# EAGLE design trico_embed01_atmpt01 (EAGLE 9.1.0)
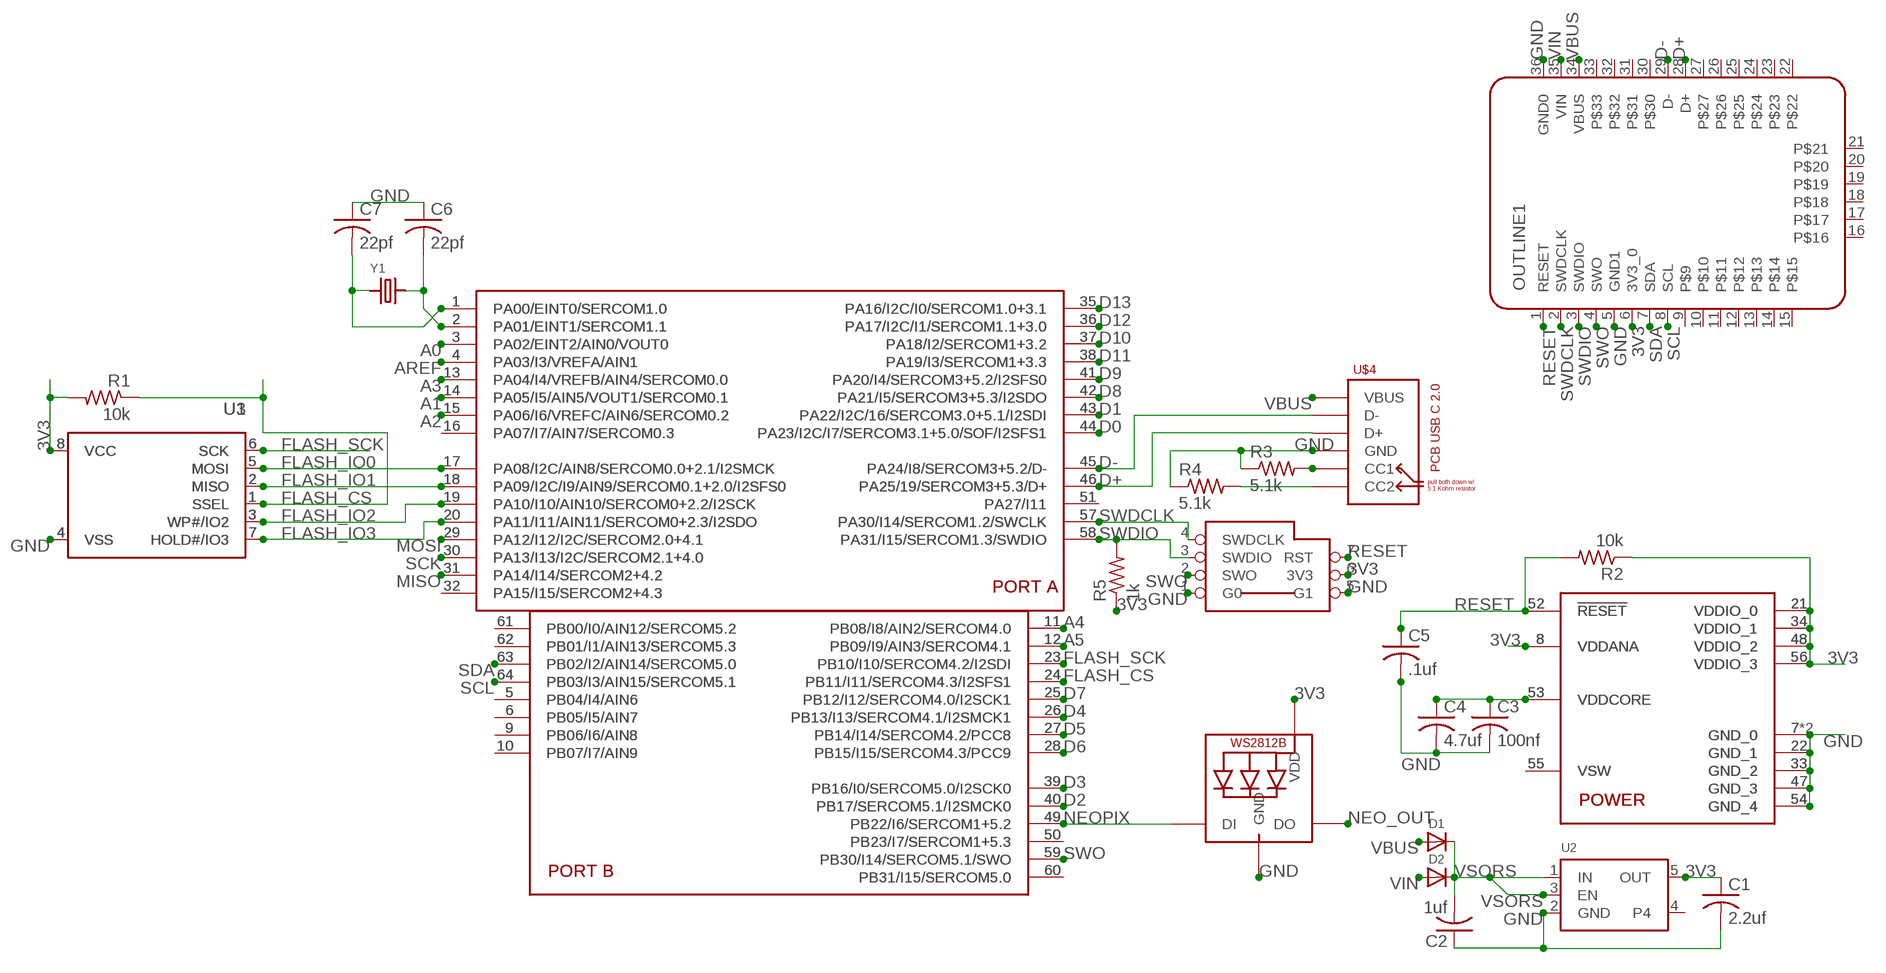
[diagram p0: schematic, sheet 1]

## Parts
C1  2.2uf  C-TG  [TG-C0805MP]
C2  1uf  C-TG  [TG-C0805MP]
C3  100nf  C-TG  [TG-C0805MP]
C4  4.7uf  C-TG  [TG-C0805MP]
C5  .1uf  C-TG  [TG-C0805MP]
C6  22pf  C-TG  [TG-C0805MP]
C7  22pf  C-TG  [TG-C0805MP]
D1  DIODESOD-123  [SOD-123]
D2  DIODESOD-123  [SOD-123]
LED1  LED-NEO-WS2812B3535  [LED3535]
OUTLINE1  TRIOC_DEV_36_EMBED_01BREAK  [TRICO_DEV_01_BRK_HYBRID]
R1  10k  R_TG  [TG-R0805]
R2  10k  R_TG  [TG-R0805]
R3  5.1k  R_TG  [TG-R0805]
R4  5.1k  R_TG  [TG-R0805]
R5  1k  R_TG  [TG-R0805]
U1  FLASH-SPI-SOIC8  [SOIC8_150MIL]
U2  VREG_STD_MIN_SOT23-5  [SOT23-5]
U3  FLASH-SPI-SOIC8208MIL  [SOIC8_208MIL]
U$1  MCU-ATSAMD51J-ADATQFP  [QFP50P1200X1200X120-64N]
U$2  MCU-ATSAMD51J-ADAADA  [MICROBUILDER_PQFN64-1]
U$3  SWD_POGO  [SWD_POGO]
U$4  USB-C-PCB-USB-2.0-TYPE-CDS_2  [USB_TYPE_C_DS_2]
Y1  XTAL_ADA4.9X1.8  [MICROBUILDER_CRYSTAL_4.9X1.8]

## Nets
3V3: C1.1 LED1.2(VDD) OUTLINE1.6(3V3_0) R1.2 R2.1 R5.1 U1.8(VCC) U2.5(OUT) U3.8(VCC) U$1.8(VDDANA) U$1.21(VDDIO_0) U$1.34(VDDIO_1) U$1.48(VDDIO_2) U$1.56(VDDIO_3) U$2.8(VDDANA) U$2.21(VDDIO_0) U$2.34(VDDIO_1) U$2.48(VDDIO_2) U$2.56(VDDIO_3) U$3.6(3V3)
A0: U$1.3(PA02/EINT2/AIN0/VOUT0) U$2.3(PA02/EINT2/AIN0/VOUT0)
A1: U$1.14(PA05/I5/AIN5/VOUT1/SERCOM0.1) U$2.14(PA05/I5/AIN5/VOUT1/SERCOM0.1)
A2: U$1.15(PA06/I6/VREFC/AIN6/SERCOM0.2) U$2.15(PA06/I6/VREFC/AIN6/SERCOM0.2)
A3: U$1.13(PA04/I4/VREFB/AIN4/SERCOM0.0) U$2.13(PA04/I4/VREFB/AIN4/SERCOM0.0)
A4: U$1.11(PB08/I8/AIN2/SERCOM4.0) U$2.11(PB08/I8/AIN2/SERCOM4.0)
A5: U$1.12(PB09/I9/AIN3/SERCOM4.1) U$2.12(PB09/I9/AIN3/SERCOM4.1)
AREF: U$1.4(PA03/I3/VREFA/AIN1) U$2.4(PA03/I3/VREFA/AIN1)
CC1: R3.2 U$4.A5(CC1)
CC2: R4.2 U$4.B5(CC2)
D0: U$1.44(PA23/I2C/I7/SERCOM3.1+5.0/SOF/I2SFS1) U$2.44(PA23/I2C/I7/SERCOM3.1+5.0/SOF/I2SFS1)
D1: U$1.43(PA22/I2C/16/SERCOM3.0+5.1/I2SDI) U$2.43(PA22/I2C/16/SERCOM3.0+5.1/I2SDI)
D2: U$1.40(PB17/SERCOM5.1/I2SMCK0) U$2.40(PB17/SERCOM5.1/I2SMCK0)
D3: U$1.39(PB16/I0/SERCOM5.0/I2SCK0) U$2.39(PB16/I0/SERCOM5.0/I2SCK0)
D4: U$1.26(PB13/I13/SERCOM4.1/I2SMCK1) U$2.26(PB13/I13/SERCOM4.1/I2SMCK1)
D5: U$1.27(PB14/I14/SERCOM4.2/PCC8) U$2.27(PB14/I14/SERCOM4.2/PCC8)
D6: U$1.28(PB15/I15/SERCOM4.3/PCC9) U$2.28(PB15/I15/SERCOM4.3/PCC9)
D7: U$1.25(PB12/I12/SERCOM4.0/I2SCK1) U$2.25(PB12/I12/SERCOM4.0/I2SCK1)
D8: U$1.42(PA21/I5/SERCOM3+5.3/I2SDO) U$2.42(PA21/I5/SERCOM3+5.3/I2SDO)
D9: U$1.41(PA20/I4/SERCOM3+5.2/I2SFS0) U$2.41(PA20/I4/SERCOM3+5.2/I2SFS0)
D10: U$1.37(PA18/I2/SERCOM1+3.2) U$2.37(PA18/I2/SERCOM1+3.2)
D11: U$1.38(PA19/I3/SERCOM1+3.3) U$2.38(PA19/I3/SERCOM1+3.3)
D12: U$1.36(PA17/I2C/I1/SERCOM1.1+3.0) U$2.36(PA17/I2C/I1/SERCOM1.1+3.0)
D13: U$1.35(PA16/I2C/I0/SERCOM1.0+3.1) U$2.35(PA16/I2C/I0/SERCOM1.0+3.1)
D+: OUTLINE1.28(D+) U$1.46(PA25/19/SERCOM3+5.3/D+) U$2.46(PA25/19/SERCOM3+5.3/D+) U$4.A6(D+) U$4.B6(D+)
D-: OUTLINE1.29(D-) U$1.45(PA24/I8/SERCOM3+5.2/D-) U$2.45(PA24/I8/SERCOM3+5.2/D-) U$4.A7(D-) U$4.B7(D-)
FLASH_CS: R1.1 U1.1(SSEL) U3.1(SSEL) U$1.24(PB11/I11/SERCOM4.3/I2SFS1) U$2.24(PB11/I11/SERCOM4.3/I2SFS1)
FLASH_IO0: U1.5(MOSI) U3.5(MOSI) U$1.17(PA08/I2C/AIN8/SERCOM0.0+2.1/I2SMCK) U$2.17(PA08/I2C/AIN8/SERCOM0.0+2.1/I2SMCK)
FLASH_IO1: U1.2(MISO) U3.2(MISO) U$1.18(PA09/I2C/I9/AIN9/SERCOM0.1+2.0/I2SFS0) U$2.18(PA09/I2C/I9/AIN9/SERCOM0.1+2.0/I2SFS0)
FLASH_IO2: U1.3(WP#/IO2) U3.3(WP#/IO2) U$1.19(PA10/I10/AIN10/SERCOM0+2.2/I2SCK) U$2.19(PA10/I10/AIN10/SERCOM0+2.2/I2SCK)
FLASH_IO3: U1.7(HOLD#/IO3) U3.7(HOLD#/IO3) U$1.20(PA11/I11/AIN11/SERCOM0+2.3/I2SDO) U$2.20(PA11/I11/AIN11/SERCOM0+2.3/I2SDO)
FLASH_SCK: U1.6(SCK) U3.6(SCK) U$1.23(PB10/I10/SERCOM4.2/I2SDI) U$2.23(PB10/I10/SERCOM4.2/I2SDI)
GND: C1.2 C2.1 C3.2 C4.2 C5.2 C6.1 C7.1 LED1.4(GND) OUTLINE1.5(GND1) OUTLINE1.36(GND0) R3.1 R4.1 U1.4(VSS) U2.2(GND) U3.4(VSS) U$1.7(GND_0) U$1.22(GND_1) U$1.33(GND_2) U$1.47(GND_3) U$1.54(GND_4) U$2.7(GND_0) U$2.22(GND_1) U$2.33(GND_2) U$2.47(GND_3) U$2.54(GND_4) U$2.EXP(GND_0) U$3.1(G0) U$3.5(G1) U$4.A1(GND) U$4.A12(GND) U$4.B1(GND) U$4.B12(GND)
MISO: U$1.31(PA14/I14/SERCOM2+4.2) U$2.31(PA14/I14/SERCOM2+4.2)
MOSI: U$1.29(PA12/I12/I2C/SERCOM2.0+4.1) U$2.29(PA12/I12/I2C/SERCOM2.0+4.1)
N$1: U$1.16(PA07/I7/AIN7/SERCOM0.3) U$2.16(PA07/I7/AIN7/SERCOM0.3)
N$2: U$1.32(PA15/I15/SERCOM2+4.3) U$2.32(PA15/I15/SERCOM2+4.3)
N$3: U$1.51(PA27/I11) U$2.51(PA27/I11)
N$4: U$1.61(PB00/I0/AIN12/SERCOM5.2) U$2.61(PB00/I0/AIN12/SERCOM5.2)
N$5: U$1.62(PB01/I1/AIN13/SERCOM5.3) U$2.62(PB01/I1/AIN13/SERCOM5.3)
N$6: U$1.5(PB04/I4/AIN6) U$2.5(PB04/I4/AIN6)
N$7: U$1.6(PB05/I5/AIN7) U$2.6(PB05/I5/AIN7)
N$8: U$1.9(PB06/I6/AIN8) U$2.9(PB06/I6/AIN8)
N$9: U$1.10(PB07/I7/AIN9) U$2.10(PB07/I7/AIN9)
N$10: U$1.50(PB23/I7/SERCOM1+5.3) U$2.50(PB23/I7/SERCOM1+5.3)
N$11: U$1.60(PB31/I15/SERCOM5.0) U$2.60(PB31/I15/SERCOM5.0)
N$12: U$1.55(VSW) U$2.55(VSW)
NEO_OUT: LED1.3(DO)
NEOPIX: LED1.1(DI) U$1.49(PB22/I6/SERCOM1+5.2) U$2.49(PB22/I6/SERCOM1+5.2)
RESET: C5.1 OUTLINE1.1(RESET) R2.2 U$1.52(!RESET) U$2.52(!RESET) U$3.7(RST)
SCK: U$1.30(PA13/I13/I2C/SERCOM2.1+4.0) U$2.30(PA13/I13/I2C/SERCOM2.1+4.0)
SCL: OUTLINE1.8(SCL) U$1.64(PB03/I3/AIN15/SERCOM5.1) U$2.64(PB03/I3/AIN15/SERCOM5.1)
SDA: OUTLINE1.7(SDA) U$1.63(PB02/I2/AIN14/SERCOM5.0) U$2.63(PB02/I2/AIN14/SERCOM5.0)
SWDCLK: OUTLINE1.2(SWDCLK) U$1.57(PA30/I14/SERCOM1.2/SWCLK) U$2.57(PA30/I14/SERCOM1.2/SWCLK) U$3.4(SWDCLK)
SWDIO: OUTLINE1.3(SWDIO) R5.2 U$1.58(PA31/I15/SERCOM1.3/SWDIO) U$2.58(PA31/I15/SERCOM1.3/SWDIO) U$3.3(SWDIO)
SWO: OUTLINE1.4(SWO) U$1.59(PB30/I14/SERCOM5.1/SWO) U$2.59(PB30/I14/SERCOM5.1/SWO) U$3.2(SWO)
VBUS: D1.A OUTLINE1.34(VBUS) U$4.A4(VBUS) U$4.A9(VBUS) U$4.B4(VBUS) U$4.B9(VBUS)
VCORE: C3.1 C4.1 U$1.53(VDDCORE) U$2.53(VDDCORE)
VIN: D2.A OUTLINE1.35(VIN)
VSORS: C2.2 D1.C D2.C U2.1(IN) U2.3(EN)
XTAL0: C6.2 U$1.2(PA01/EINT1/SERCOM1.1) U$2.2(PA01/EINT1/SERCOM1.1) Y1.2
XTAL1: C7.2 U$1.1(PA00/EINT0/SERCOM1.0) U$2.1(PA00/EINT0/SERCOM1.0) Y1.1
Unconnected: OUTLINE1.9 OUTLINE1.10 OUTLINE1.11 OUTLINE1.12 OUTLINE1.13 OUTLINE1.14 OUTLINE1.15 OUTLINE1.16 OUTLINE1.17 OUTLINE1.18 OUTLINE1.19 OUTLINE1.20 OUTLINE1.21 OUTLINE1.22 OUTLINE1.23 OUTLINE1.24 OUTLINE1.25 OUTLINE1.26 OUTLINE1.27 OUTLINE1.30 OUTLINE1.31 OUTLINE1.32 OUTLINE1.33 U2.4

## Library data of the parts
C1-C7 = 0TG-Lib v01.3:C-TG
D1 D2 = 0TG-Lib v01.4:DIODE: Diode from: adafruit SMA Model Volts Amps Type Vf Ir Digikey # Notes SSA34-E3 40V 3A Schottky 480mV @ 3A 200uA @ 40V SSA34-E3/61TGITR-ND CDBA120-G 20V 1A Schottky 500mV @ 1A 500uA @ 20V 641-1014-6-ND REEL MBRA210 10V 2A Schottky 350mV @ 2A 700uA @ 10V MBRA210LT3 SOD-123 Model Volts Amps Type Vf Ir Order # Notes BAT54T1G 30V 200mA Schottky 800mV @ 200mA 2uA @ 25V BAT54T1GOSTR-ND B0530W 30V 500mA Schottky 430mV @ 500mA 130uA @ 30V B0530W-FDICT-ND REEL MBR120 20V 1A Schottky 340mV @ 1A MBR120VLSFT1GOSCT-ND SOD-323 Model Volts Amps Type Vf Ir Order # Notes PMEG2005EJ 20V 500mA Schottky 355mV @ 500mA 568-4110-1-ND ZLLS410 10V 570mA Schottky 380mV @ 570mA ZLLS410CT-ND 1N4148WS 75V 150mA Silicon/Simple 1V 1N4148WSFSCT-ND REEL SOD-523 Model Volts Amps Type Vf Ir Order # Notes BAT54XV2 30V 200mA Schottky 0.8V @ 100mA BAT54XV2CT-ND TB751S 30V 30mA Schottky RB751S-40TE61CT-ND SOT23-R/W (R = Solder Paste/Reflow Ovens, W = Hand-Soldering) Model Volts Amps Type Vf Ir Order # Notes BAT54FILM 40V 300mA Schottky 497-7162-1-ND POWERDI-5 Model Volts Amps Type Vf Ir Order # Notes PDS560 60V 5A Schottky 670mV @ 5A 150uA @ 60V PDS560DICT-ND
LED1 = 0TG-Lib v01.3:LED-NEO-WS2812B: from: adafruit
OUTLINE1 = 0Trico04_lib:TRIOC_DEV_36_EMBED_01
R1 R2 R5 = 0TG-Lib v01.3:R_TG
R3 R4 = 0TG-Lib v01.4:R_TG
U1 U3 = 0TG-Lib v01.3:FLASH-SPI-SOIC8: SOIC8 SPI Flash Be careful with the size since SOIC8 flash comes in several 'widths' SOIC8 150 mil M25P16 - 16Mbit (2Mbit x 8) Serial Flash (75MHz SPI Bus), Supply: 2.7-3.6V Digikey: SOIC8 - M25P16-VMN6P-ND SOIC8 208 mil W25Q16BVSSIG - 16Mbit (2Mbit x 8) Serial Flash (104MHz SPI Bus), Supply: 2.7-3.6V Digikey: SOIC8 - W25Q16BVSSIG-ND from: adafruit availability low
U2 = 0TG-Lib v01.3:VREG_STD_MIN_SOT23-5: SOT23-5 Fixed Voltage Regulators from: adafruit Part Current Out V Out V In V Dropout θJA (°C/W) TJ (°C) Digikey Part No. ADP121 150mA 3.3V 3.4-5.5V 0.09V @ 150mA -- -- ADP121-AUJZ33R7CT-ND ADP121 150mA 3.0V 3.1-5.5V 0.09V @ 150mA -- -- ADP121-AUJZ30R7CT-ND ADP122 300mA 3.3V 3.4-5.5V 0.085V @ 300mA -- -- ADP122AUJZ-3.3-R7CT-ND ADP1712 300mA 3.3V 3.5-5.5V 0.17V @ 300mA -- -- ADP1712AUJZ-3.3-R7TR-ND AP7311 (Low Cost) 150mA 3.3V 3.5-6V 0.15V @ 150mA -- -- AP7311-33WG-7DICT-ND LD39015M18R 150mA 1.8V 1.9V-5.5V 0.08V @ 100mA -- -- 497-6977-1-ND LP2985A-33DBVR 150mA 3.3V 3.3-16V 0.28V @ 150mA 206 150 296-18479-1-ND MCP1824T-3302E/OT 300mA 3.3V 3.5V-6V 0.2V @ 300mA -- -- MCP1824T-3302E/OTCT-ND MIC5205-2.5YM5 TR 150mA 2.5V 2.7-16V 0.165V @ 150mA -- -- 576-1257-2-ND MIC5205-3.0YM5 TR 150mA 3.0V 3.2V-16V 0.165V @ 150mA -- -- 576-1258-2-ND MIC5205-3.3YM5 TR 150mA 3.3V 3.5V-16V 0.165V @ 150mA -- -- 576-1259-2-ND TPS780330220 150mA 3.3V+2.2V 3.6-5.5V 250mV Max -- -- 296-23332-1-ND TDA3663/N1,135 100mA 3.3V 3.5-45V 0.18V @ 50mA -- -- 568-5343-1-ND Max operating temp can be calculated using θJA, TJ (max junction temperature), and power in watts. Set the "Maximum Ambient Temperature" until it reaches TJ ("Max Junction Temperature"), which is the absolute limit for safe use of the regulator: Heat Sink Temperature Calculator <http://www.daycounter.com/Calculators/Heat-Sink-Temperature-Calculator.phtml> For example, With 12V source into a 3.3V LP2985 and a 30mA load, we are dissipating (12V-3.3V) * 0.03A = 0.261W. With a θJA of 206 °C/W, a TJ of 150°C, and 261mW we can safely use the chip without a heat sink up to 75°C (=147.1°C Junction Temperature).
U$1 = 0TG-Lib v01.3:MCU-ATSAMD51J-ADA: ATSAMD51J cortex m4 microcontroller from: adafruit altered: TG-Techie
U$2 = 0TG-Lib v01.4:MCU-ATSAMD51J-ADA: ATSAMD51J cortex m4 microcontroller from: adafruit altered: TG-Techie
U$3 = board packages dev:SWD_POGO
U$4 = 0TG-Lib v01.4:USB-C-PCB-USB-2.0-TYPE-C: from: Pinuct on github, many thanks!
Y1 = 0TG-Lib v01.3:XTAL_ADA: Crystals HC49UP - Surface Mount Crystal 4.0MHz 18pF +/-30ppm Surface Mount Crystal [Digikey: 535-9857-1-ND] 12.0 MHz Surface Mount Crystal [Digikey: 535-9869-6-ND] 25.0 MHz Surface Mount Crystal [Digikey: 535-9078-1-ND] 2.5 x 2.0mm - MEMs SMT Crystal 16.0 MHz 10pF 20ppm 2.5 x 2.0mm Crystal [Digikey -40-85°C: 535-10923-1-ND] 3.2 x 2.5mm - MEMs SMT Crystal 12.0 MHz 8pF 15ppm 3.2 x 2.5mm Crystal [Digikey: -10-70°C: 644-1047-1-ND -40-125°C: 644-1128-1-ND] 16.0 MHz 8pF 15ppm 3.2 x 2.5mm Crystal [Digikey: -10-70°C: 644-1049-1-ND -40-125°C: 644-1129-2-ND] 16.0 MHz 10pF 10ppm 3.2 x 2.5mm Crystal [Digikey: 644-1100-1-ND] 27.12 MHz 18pF 30ppm 3.2 x 2.5mm Crystal [Digikey: 887-1424-1-ND] 27.12MHz 10pF 10ppm 3.2 x 2.5mm Crystal [Digikey: 887-1329-1-ND] 4.9 x 1.8mm - MEMs SMT Crystal 32.768 KHz 12.5pF 20ppm 4.9 x 1.8mm Crystal [Digikey: SE2415CT-ND] 8.0 x 3.8mm - Surface Mount Crystal 32.768kHz 12.5pF 20ppm -40°C-85°C [Digikey: 535-9166-2-ND] Cylinder 32.768KHz Cylinder Crystal (2x6mm body) [Ex. Digikey: 300-8341-2-ND]

## Board
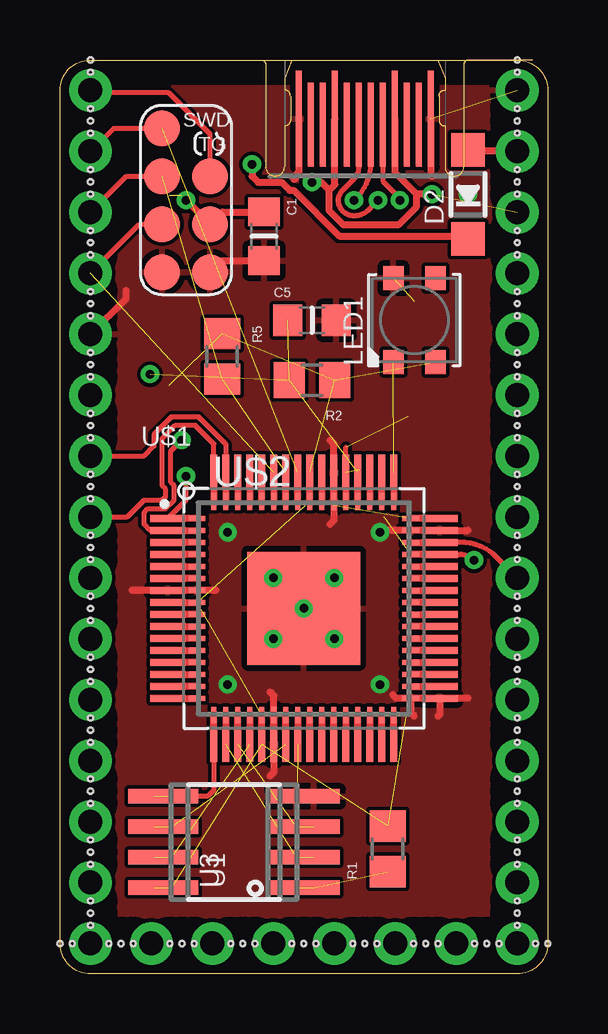
[diagram p1: board, top side]
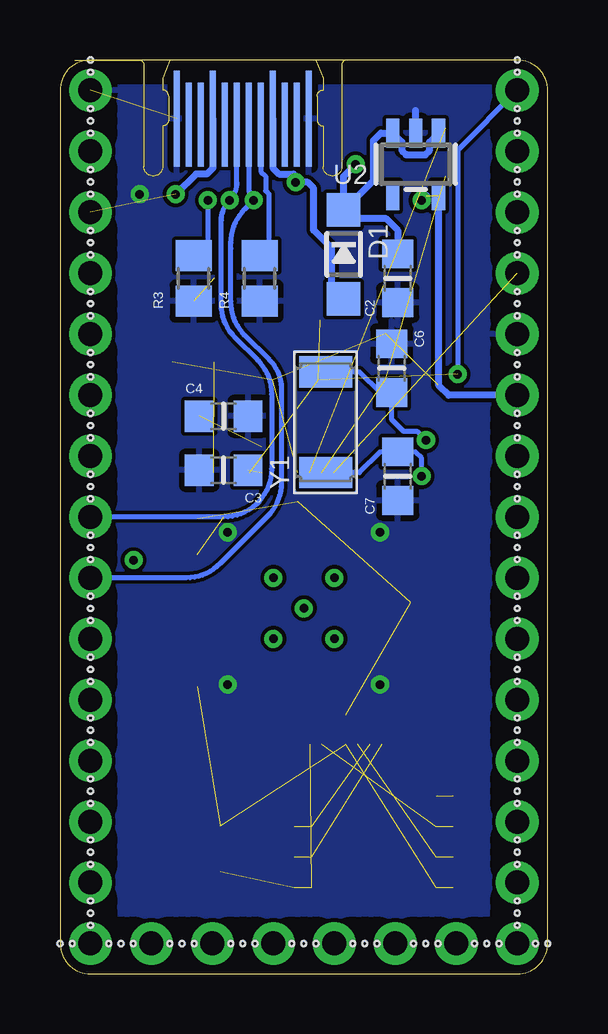
[diagram p2: board, bottom side, seen from below]

Size 20.32 x 38.1 mm. Coordinates in mm from the lower left corner, seen from the top.
Copper layers (1*16): Top 0.035mm / dielectric 1.5mm / Bottom 0.035mm
Design rules "default": minimum track width 6mil, minimum drill 0.35mm, track to track 6mil, track to pad 6mil, pad to pad 6mil, via to via 6mil, smd to smd 6mil, copper to edge 40mil, drill to drill 6mil, minimum pad ring 10mil, minimum via ring 8mil, stop-mask expansion 4mil, vias tented up to drill 0mil, thermal gap 10mil

### Footprints (pad centres in the part's own frame; a part is rotated, then mirrored left to right if it is on the bottom)
TG-C0805MP = smd 1.2 x 1.3: 1 -1.016,0; 2 1.016,0
SOD-123 = smd 1.4 x 1.4: A 1.85,0; C -1.85,0
LED3535 = smd 1 x 0.85: 1 -1.75,0.875; 2 -1.75,-0.875; 3 1.75,-0.875; 4 1.75,0.875
TRICO_DEV_01_BRK_HYBRID = drill 1 pad 1.778: 1 -8.89,35.56; 2 -8.89,33.02; 3 -8.89,30.48; 4 -8.89,27.94; 5 -8.89,25.4; 6 -8.89,22.86; 7 -8.89,20.32; 8 -8.89,17.78; 9 -8.89,15.24; 10 -8.89,12.7; 11 -8.89,10.16; 12 -8.89,7.62; 13 -8.89,5.08; 14 -8.89,2.54; 15 -8.89,0; 16 -6.35,0; 17 -3.81,0; 18 -1.27,0; 19 1.27,0; 20 3.81,0; 21 6.35,0; 22 8.89,0; 23 8.89,2.54; 24 8.89,5.08; 25 8.89,7.62; 26 8.89,10.16; 27 8.89,12.7; 28 8.89,15.24; 29 8.89,17.78; 30 8.89,20.32; 31 8.89,22.86; 32 8.89,25.4; 33 8.89,27.94; 34 8.89,30.48; 35 8.89,33.02; 36 8.89,35.56 | hole 0.2: -8.89,34.798; -8.89,33.782; -8.89,34.29; -8.89,31.242; -8.89,31.75; -8.89,32.258; -8.89,28.702; -8.89,29.21; -8.89,29.718; -8.89,26.162; -8.89,26.67; -8.89,27.178; -8.89,23.622; -8.89,24.13; -8.89,24.638; -8.89,21.082; -8.89,21.59; -8.89,22.098; -8.89,18.542; -8.89,19.05; -8.89,19.558; -8.89,16.002; -8.89,16.51; -8.89,17.018; -8.89,13.462; -8.89,13.97; -8.89,14.478; -8.89,10.922; -8.89,11.43; -8.89,11.938; -8.89,8.382; -8.89,8.89; -8.89,9.398; -8.89,5.842; -8.89,6.35; -8.89,6.858; -8.89,3.302; -8.89,3.81; -8.89,4.318; -8.89,0.762; -8.89,1.27; -8.89,1.778; -7.112,0; -7.62,0; -8.128,0; 8.89,3.302; 8.89,4.318; 8.89,3.81; 8.89,6.858; 8.89,6.35; 8.89,5.842; 8.89,9.398; 8.89,8.89; 8.89,8.382; 8.89,11.938; 8.89,11.43; 8.89,10.922; 8.89,14.478; 8.89,13.97; 8.89,13.462; 8.89,17.018; 8.89,16.51; 8.89,16.002; 8.89,19.558; 8.89,19.05; 8.89,18.542; 8.89,22.098; 8.89,21.59; 8.89,21.082; 8.89,24.638; 8.89,24.13; 8.89,23.622; 8.89,27.178; 8.89,26.67; 8.89,26.162; 8.89,29.718; 8.89,29.21; 8.89,28.702; 8.89,32.258; 8.89,31.75; 8.89,31.242; 8.89,34.798; 8.89,34.29; 8.89,33.782; 8.89,0.762; 8.89,1.27; 8.89,1.778; -4.572,0; -5.08,0; -5.588,0; -2.032,0; -2.54,0; -3.048,0; 0.508,0; 0,0; -0.508,0; 8.128,0; 7.62,0; 7.112,0; 5.588,0; 5.08,0; 4.572,0; 3.048,0; 2.54,0; 2.032,0; 10.16,0; 9.652,0; -9.652,0; -10.16,0; -8.89,36.322; -8.89,36.83; 8.89,36.322; 8.89,36.83
TG-R0805 = smd 1.3 x 1.5: 1 -0.95,0; 2 0.95,0
SOIC8_150MIL = smd 0.6 x 2.2: 1 -1.905,-2.6; 2 -0.635,-2.6; 3 0.635,-2.6; 4 1.905,-2.6; 5 1.905,2.6; 6 0.635,2.6; 7 -0.635,2.6; 8 -1.905,2.6
SOT23-5 = smd 0.55 x 1.2: 1 -0.95,-1.3; 2 0,-1.3; 3 0.95,-1.3; 4 0.95,1.3; 5 -0.95,1.3
SOIC8_208MIL = smd 0.6 x 2.2: 1 -1.905,-3.315; 2 -0.635,-3.315; 3 0.635,-3.315; 4 1.905,-3.315; 5 1.905,3.315; 6 0.635,3.315; 7 -0.635,3.315; 8 -1.905,3.315
QFP50P1200X1200X120-64N = smd 1.47 x 0.28: 1 -5.67,3.75; 2 -5.67,3.25; 3 -5.67,2.75; 4 -5.67,2.25; 5 -5.67,1.75; 6 -5.67,1.25; 7 -5.67,0.75; 8 -5.67,0.25; 9 -5.67,-0.25; 10 -5.67,-0.75; 11 -5.67,-1.25; 12 -5.67,-1.75; 13 -5.67,-2.25; 14 -5.67,-2.75; 15 -5.67,-3.25; 16 -5.67,-3.75; 33 5.67,-3.75; 34 5.67,-3.25; 35 5.67,-2.75; 36 5.67,-2.25; 37 5.67,-1.75; 38 5.67,-1.25; 39 5.67,-0.75; 40 5.67,-0.25; 41 5.67,0.25; 42 5.67,0.75; 43 5.67,1.25; 44 5.67,1.75; 45 5.67,2.25; 46 5.67,2.75; 47 5.67,3.25; 48 5.67,3.75 | smd 0.28 x 1.47: 17 -3.75,-5.67; 18 -3.25,-5.67; 19 -2.75,-5.67; 20 -2.25,-5.67; 21 -1.75,-5.67; 22 -1.25,-5.67; 23 -0.75,-5.67; 24 -0.25,-5.67; 25 0.25,-5.67; 26 0.75,-5.67; 27 1.25,-5.67; 28 1.75,-5.67; 29 2.25,-5.67; 30 2.75,-5.67; 31 3.25,-5.67; 32 3.75,-5.67; 49 3.75,5.67; 50 3.25,5.67; 51 2.75,5.67; 52 2.25,5.67; 53 1.75,5.67; 54 1.25,5.67; 55 0.75,5.67; 56 0.25,5.67; 57 -0.25,5.67; 58 -0.75,5.67; 59 -1.25,5.67; 60 -1.75,5.67; 61 -2.25,5.67; 62 -2.75,5.67; 63 -3.25,5.67; 64 -3.75,5.67
MICROBUILDER_PQFN64-1 = smd 0.7 x 0.22: 1 -4.45,3.75; 2 -4.45,3.25; 3 -4.45,2.75; 4 -4.45,2.25; 5 -4.45,1.75; 6 -4.45,1.25; 7 -4.45,0.75; 8 -4.45,0.25; 9 -4.45,-0.25; 10 -4.45,-0.75; 11 -4.45,-1.25; 12 -4.45,-1.75; 13 -4.45,-2.25; 14 -4.45,-2.75; 15 -4.45,-3.25; 16 -4.45,-3.75; 33 4.45,-3.75; 34 4.45,-3.25; 35 4.45,-2.75; 36 4.45,-2.25; 37 4.45,-1.75; 38 4.45,-1.25; 39 4.45,-0.75; 40 4.45,-0.25; 41 4.45,0.25; 42 4.45,0.75; 43 4.45,1.25; 44 4.45,1.75; 45 4.45,2.25; 46 4.45,2.75; 47 4.45,3.25; 48 4.45,3.75 | smd 0.22 x 0.7: 17 -3.75,-4.45; 18 -3.25,-4.45; 19 -2.75,-4.45; 20 -2.25,-4.45; 21 -1.75,-4.45; 22 -1.25,-4.45; 23 -0.75,-4.45; 24 -0.25,-4.45; 25 0.25,-4.45; 26 0.75,-4.45; 27 1.25,-4.45; 28 1.75,-4.45; 29 2.25,-4.45; 30 2.75,-4.45; 31 3.25,-4.45; 32 3.75,-4.45; 49 3.75,4.45; 50 3.25,4.45; 51 2.75,4.45; 52 2.25,4.45; 53 1.75,4.45; 54 1.25,4.45; 55 0.75,4.45; 56 0.25,4.45; 57 -0.25,4.45; 58 -0.75,4.45; 59 -1.25,4.45; 60 -1.75,4.45; 61 -2.25,4.45; 62 -2.75,4.45; 63 -3.25,4.45; 64 -3.75,4.45 | smd 4.7 x 4.7: EXP 0,0
SWD_POGO = smd 1.5 x 1.5: 1 -1,-2; 2 -1,0; 3 -1,2; 4 -1,4; 5 1,-2; 6 1,0; 7 1,2
USB_TYPE_C_DS_2 = smd 0.25 x 4: A1 2.75,-2.45; A4 1.25,-2.45; A9 -1.25,-2.45; A12 -2.75,-2.45 | smd 0.25 x 3.5: A2 2.25,-2.7; A3 1.75,-2.7; A5 0.75,-2.7; A6 0.25,-2.7; A7 -0.25,-2.7; A8 -0.75,-2.7; A10 -1.75,-2.7; A11 -2.25,-2.7 | smd 0.25 x 4 bottom: B1 -2.75,-2.45; B4 -1.25,-2.45; B9 1.25,-2.45; B12 2.75,-2.45 | smd 0.25 x 3.5 bottom: B2 -2.25,-2.7; B3 -1.75,-2.7; B5 -0.75,-2.7; B6 -0.25,-2.7; B7 0.25,-2.7; B8 0.75,-2.7; B10 1.75,-2.7; B11 2.25,-2.7
MICROBUILDER_CRYSTAL_4.9X1.8 = smd 1.3 x 2.2: 1 -2.1,0; 2 2.1,0

### Placement (x,y rotation side)
C1  8.5,30.75 270 top
C2  6.25,29 90 bottom
C3  13.5,21 180 bottom
C4  13.5,23.25 0 bottom
C5  10.5,27.25 0 top
C6  6.5,25.25 270 bottom
C7  6.25,20.75 90 bottom
D1  8.5,30 270 bottom
D2  17,32.5 90 top
LED1  14.77,27.26 90 top
OUTLINE1  10.16,1.27 0 top
R1  13.65,5.22 90 top
R2  10.5,24.75 180 top
R3  14.75,29 90 bottom
R4  12,29 90 bottom
R5  6.75,25.75 270 top
U1  7.25,5.5 90 top
U2  5.5,33.75 180 bottom
U3  7.25,5.5 90 top
U$1  10.16,15.24 0 top
U$2  10.16,15.24 0 top
U$3  5.25,31.25 0 top
U$4  12.7,38.1 0 top
Y1  9.25,23 90 bottom

### Tracks (layer width: path | path; a pad name or v marks a point on that pad's centre or on a via)
3V3  (via drill 0.35)  (12 unrouted)
  Top 0.3: v5.25,32.25 U$3.6 6.77,31.77 C1.1 | U$2.56 U$1.56 | U$1.8 U$2.8 | U$1.21 U$2.21 | U$1.48 U$2.48 | U$2.34 U$1.34
  Bottom 0.3: v5.25,32.25 5.05,32.45 | U2.5 4.55,24.55 4.13,24.13 OUTLINE1.6
A0
  Top 0.3: U$2.3 U$1.3
A1
  Top 0.3: U$1.14 U$2.14
A2
  Top 0.3: U$2.15 U$1.15
A3
  Top 0.3: U$2.13 U$1.13
A4
  Top 0.3: U$2.11 U$1.11
A5
  Top 0.3: U$1.12 U$2.12
AREF
  Top 0.3: U$2.4 U$1.4
CC1  (via drill 0.35)
  Top 0.2: U$4.A5 13.45,33.05 14.16,32.34 v14.16,32.25
  Bottom 0.2: v14.16,32.25 14.16,30.54 R3.2
CC2
  Bottom 0.2: U$4.B5 11.95,33.45 11.75,33.25 11.75,32.64 11.62,32.51 11.62,30.37 arc45 11.65,30.3 | R4.2 11.65,30.3 | 11.65,30.3 11.62,30.33
D0
  Top 0.3: U$2.44 U$1.44
D1
  Top 0.3: U$1.43 U$2.43
D2
  Top 0.3: U$2.40 U$1.40
D3
  Top 0.3: U$1.39 U$2.39
D4
  Top 0.3: U$2.26 U$1.26
D5
  Top 0.3: U$1.27 U$2.27
D6
  Top 0.3: U$2.28 U$1.28
D7
  Top 0.3: U$1.25 U$2.25
D8
  Top 0.3: U$2.42 U$1.42
D9
  Top 0.3: U$1.41 U$2.41
D10
  Top 0.3: U$1.37 U$2.37
D11
  Top 0.3: U$2.38 U$1.38
D12
  Top 0.3: U$2.36 U$1.36
D13
  Top 0.3: U$1.35 U$2.35
D+  (via drill 0.35)
  Top 0.2: OUTLINE1.28 18.16,17.4 arc45 16.74,17.99 U$1.46 | v12.25,32.25 12.36,32.36 arc45 12.95,33.78 U$4.A6
  Top 0.3: U$2.46 U$1.46
  Bottom 0.2: U$4.B6 12.45,32.73 arc-45 v12.25,32.25 12.61,31.89 arc-45 13.2,30.47 13.2,30.25 13.2,28.03 arc-45 12.61,26.61 11.59,25.59 arc45 11.1,24.41 11.1,20.48 arc45 11.69,19.06 13.65,17.1 arc45 15.07,16.51 OUTLINE1.28
D-  (via drill 0.35)  (1 unrouted)
  Top 0.2: U$1.45 16.67,17.49 arc-45 v17.25,17.25 | v13.25,32.25 12.85,31.85 arc-45 12.25,31.6 arc-90 11.6,32.25 arc-45 11.78,32.68 12.27,33.17 arc45 12.45,33.6 U$4.A7
  Top 0.3: U$1.45 U$2.45
  Bottom 0.2: v17.25,17.25 17.25,17.29 | U$4.B7 12.95,32.97 arc45 v13.25,32.25 arc-45 13.6,31.41 13.6,27.93 arc-45 13.01,26.51 12.09,25.59 arc45 11.5,24.17 11.5,21.05 arc90 13.5,19.05 OUTLINE1.29
FLASH_CS  (3 unrouted)
  Top 0.3: U$2.24 U$1.24
FLASH_IO0  (1 unrouted)
  Top 0.2: U$1.17 6.41,7.66 6.16,7.41 U3.5
  Top 0.3: U$1.17 U$2.17
FLASH_IO1  (2 unrouted)
  Top 0.3: U$2.18 U$1.18
FLASH_IO2  (2 unrouted)
  Top 0.3: U$1.19 U$2.19
FLASH_IO3  (2 unrouted)
  Top 0.3: U$2.20 U$1.20
FLASH_SCK  (2 unrouted)
  Top 0.3: U$1.23 U$2.23
GND  (via drill 0.35)  (2 unrouted)
  Top 0.3: OUTLINE1.5 2.75,28.15 2.75,28.5 | U$2.54 U$1.54 | U$2.7 U$1.7 | U$2.22 U$1.22 | U$1.47 U$2.47 | U$1.33 U$2.33 14.61,10.89 14.75,10.75 | U$1.54 11.41,18.91 11.25,18.75 | U$1.47 13.41,18.49 v13.34,18.41 | U$1.33 14.01,11.49 13.87,11.63 | U$1.22 8.91,11.59 8.75,11.75 | U$1.7 6.5,16 | U$1.7 3.01,15.99 3,16 | U$1.22 8.91,8.41 8.75,8.25 | U$1.33 17,11.5 | U$1.33 15.83,10.83 15.75,10.75 | U$1.47 16.99,18.49 17,18.5 | U$1.54 11.41,22.09 11.25,22.25 | U$3.5 6.73,29.73 C1.2 | U$4.B12 15.45,33.3 15.5,33.25 | U$4.B1 9.95,33.41 9.82,33.28 9.82,33.19 9.75,33.12
  Bottom 0.3: U2.2 5.5,36
  other vias: 6.99,18.41 6.99,12.06 13.34,12.06 17,32.5
  pour Top: -0.75,38.5 20.75,38.5 20.75,-0.5 -0.75,-0.5
  pour Bottom: -1,38.5 -1,-0.75 21,-0.75 21,38.5
GND4  (via drill 0.35)
  other vias: 11.43,16.51
GND5  (via drill 0.35)
  other vias: 8.89,16.51
GND6  (via drill 0.35)
  other vias: 8.89,13.97
GND7  (via drill 0.35)
  other vias: 11.43,13.97
GND8  (via drill 0.35)
  other vias: 10.16,15.24
MISO
  Top 0.3: U$1.31 U$2.31
MOSI
  Top 0.3: U$1.29 U$2.29
N$1
  Top 0.3: U$1.16 U$2.16
N$2
  Top 0.3: U$1.32 U$2.32
N$3
  Top 0.3: U$1.51 U$2.51
N$4
  Top 0.3: U$1.61 U$2.61
N$5
  Top 0.3: U$1.62 U$2.62
N$6
  Top 0.3: U$1.5 U$2.5
N$7
  Top 0.3: U$2.6 U$1.6
N$8
  Top 0.3: U$2.9 U$1.9
N$9
  Top 0.3: U$1.10 U$2.10
N$10
  Top 0.3: U$2.50 U$1.50
N$11
  Top 0.3: U$2.60 U$1.60
N$12
  Top 0.3: U$1.55 U$2.55
NEOPIX  (1 unrouted)
  Top 0.3: U$1.49 U$2.49
RESET  (via drill 0.35)  (3 unrouted)
  Top 0.2: U$3.7 6.25,35 4.5,36.75 1.35,36.75 OUTLINE1.1
  Top 0.3: U$2.52 U$1.52
  Bottom 0.2: 1.92,36.83 OUTLINE1.1 3.75,34.35 v3.75,25
SCK
  Top 0.3: U$2.30 U$1.30
SCL
  Top 0.2: U$1.64 6.41,22.09 5.62,22.88 5,22.88 4.81,22.88 4.46,22.54 4.27,22.34 4.27,20.34 4.4,20.21 4.4,19.89 4.25,19.75 3.5,19.75 2.8,19.05 OUTLINE1.8
  Top 0.3: U$1.64 U$2.64
SDA
  Top 0.2: OUTLINE1.7 3.5,21.59 3.92,22 3.92,22.48 4.66,23.23 5.76,23.23 6.91,22.09 U$1.63
  Top 0.3: U$1.63 U$2.63
SWDCLK  (1 unrouted)
  Top 0.2: OUTLINE1.2 2.23,35.25 U$3.4
  Top 0.3: U$2.57 U$1.57
SWDIO  (2 unrouted)
  Top 0.2: OUTLINE1.3 2.77,33.25 U$3.3
  Top 0.3: U$2.58 U$1.58
SWO  (1 unrouted)
  Top 0.2: OUTLINE1.4 3.31,31.25 U$3.2
  Top 0.3: U$1.59 U$2.59
VBUS  (via drill 0.35)  (1 unrouted)
  Top 0.3: 14.84,32.53 14.84,31.97 14.09,31.22 11.82,31.22 11.22,31.82 11.22,32.68 | U$4.B9 13.95,33.42 14.84,32.53 | 11.22,32.68 11.45,32.91 U$4.A9 | v10.5,33 10.89,33 11.22,32.68 | v15.5,32.5 14.87,32.5 14.84,32.53
  Bottom 0.3: U$4.A9 11.45,33.6 11.2,33.35 10.6,33.35 10.5,33.25 v10.5,33 10,33 9.75,32.75 9.75,31 9,30.25 9,28.65 D1.A | v15.5,32.5 14.65,33.35 14.2,33.35 13.95,33.6 U$4.B9
VCORE  (2 unrouted)
  Top 0.2: U$1.53 11.91,21.95
  Top 0.3: U$1.53 U$2.53
VIN
  Top 0.3: OUTLINE1.35 17.06,34.29 D2.A
VSORS  (via drill 0.35)
  Top 0.3: D2.C 16.89,30.77 11.63,30.77 9.73,32.67 9.56,32.67 9.23,33 8.25,33 8,33.25 v8,33.75
  Bottom 0.3: U2.1 4.92,34.68 4.92,34.33 5.1,34.15 5.9,34.15 6.08,34.33 6.08,34.68 U2.3 6.95,35.05 7.25,34.75 7.25,33.1 D1.C | D1.C 8.15,31.5 6.75,31.5 6.25,31 C2.2 | D1.C 8.5,33.25 v8,33.75
XTAL0  (via drill 0.35)
  Top 0.2: U$1.2 3.75,18.5 3.5,18.75 3.5,19.23 3.66,19.39 4.39,19.39 4.75,19.75 4.75,20.36 4.62,20.49 4.62,21.8 v5.07,22.25
  Top 0.3: U$1.2 U$2.2
  Bottom 0.2: Y1.2 7.85,25.1 6.98,24.23 C6.2 6.5,23.12 6,22.62 5.44,22.62 v5.07,22.25
XTAL1  (via drill 0.35)
  Top 0.2: U$1.1 5.25,19.75 v5.25,20.75
  Top 0.3: U$2.1 U$1.1
  Bottom 0.2: Y1.1 7.85,20.9 6.98,21.77 C7.2 5.52,21.77 5.25,21.5 v5.25,20.75